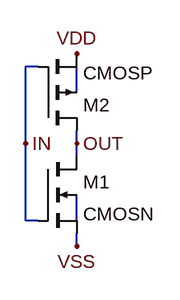
[diagram p0: schematic inv_x1.asc]
inv_x1.asc, the LTspice schematic file:
Version 4
SHEET 1 880 680
WIRE 160 48 144 48
WIRE 208 80 208 48
WIRE 144 144 144 48
WIRE 208 144 208 128
WIRE 208 160 208 144
WIRE 144 240 144 144
WIRE 160 240 144 240
WIRE 208 240 208 208
WIRE 208 272 208 256
FLAG 208 32 VDD
FLAG 208 272 VSS
FLAG 144 144 IN
FLAG 208 144 OUT
SYMBOL cmosn 160 160 R0
SYMATTR InstName M1
SYMATTR Value2 l=180nm w=1um
SYMBOL cmosp 160 128 M180
SYMATTR InstName M2
SYMATTR Value2 l=180nm w=5um

The netlist it stands for:
* inv_x1.asc
M1 OUT IN VSS N002 CMOSN l=180nm w=1um
M2 OUT IN VDD N001 CMOSP l=180nm w=5um
.model NMOS NMOS
.model PMOS PMOS
.lib standard.mos
.backanno
.end